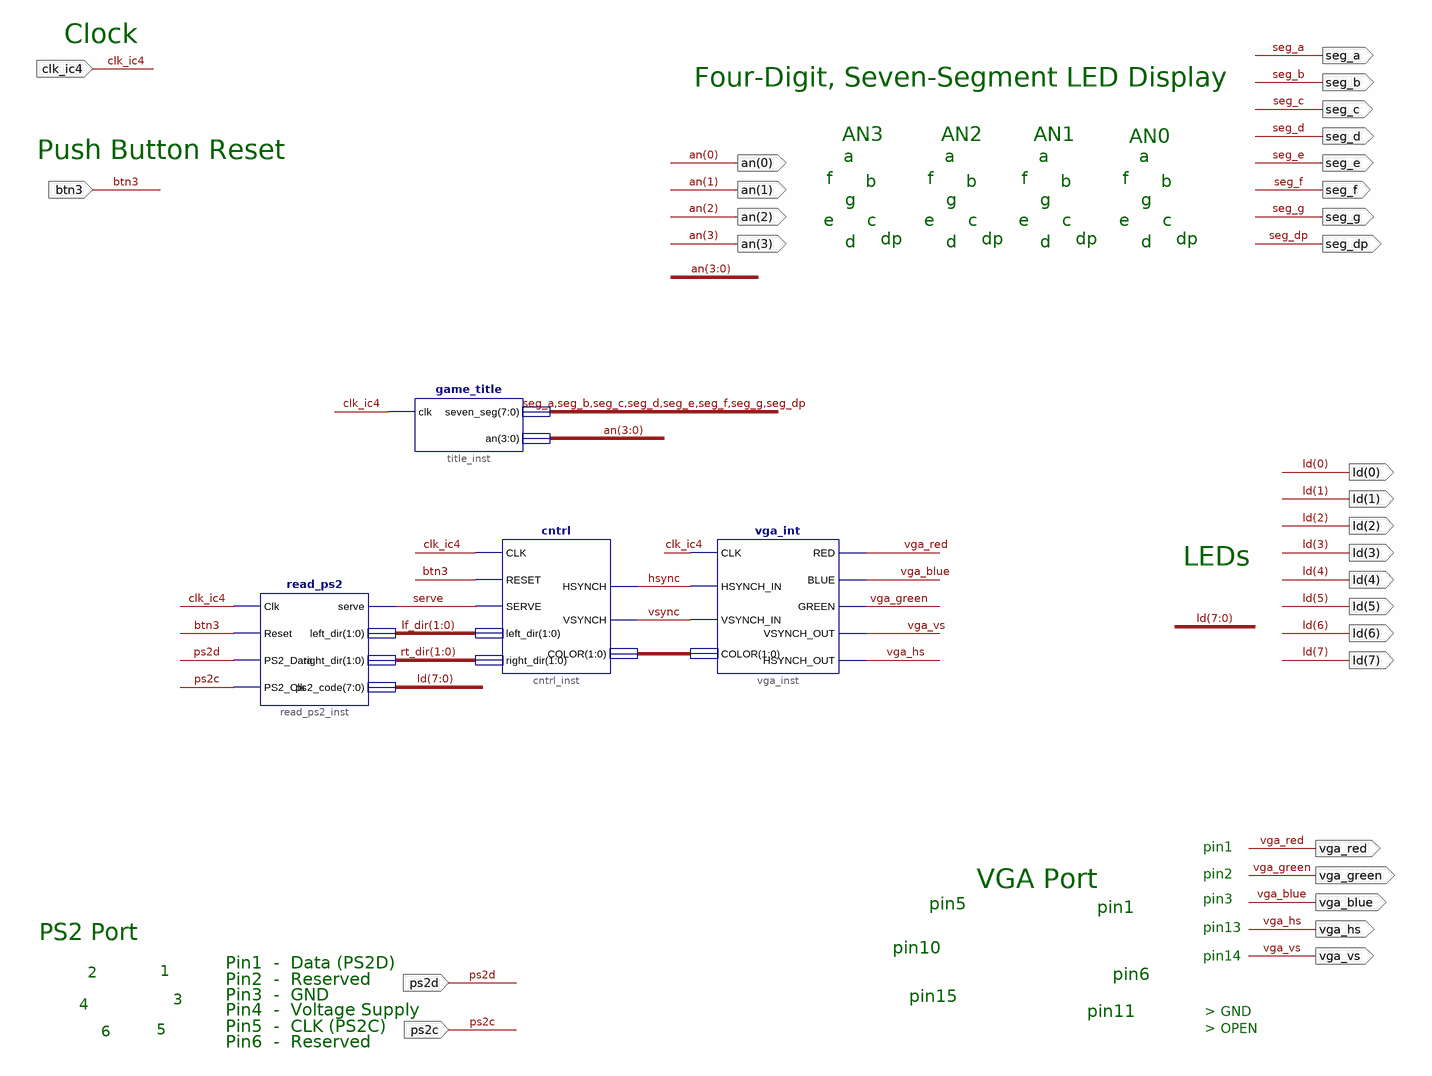
[diagram p0: schematic sheet 1]
// Xilinx ISE schematic pong_top.sch (spartan3e) as structural Verilog: 4 symbols, 29 ports
module pong_top (
  input  ps2c,
  input  clk_ic4,
  input  ps2d,
  input  btn3,
  output seg_a,
  output seg_b,
  output seg_c,
  output seg_d,
  output seg_e,
  output seg_f,
  output seg_g,
  output seg_dp,
  output [3:0] an,
  output vga_red,
  output vga_green,
  output vga_blue,
  output vga_hs,
  output vga_vs,
  output [7:0] ld
);

  wire hsync, serve, vsync;
  wire [1:0] lf_dir, rt_dir, XLXN_31;

  read_ps2 read_ps2_inst (
    .Clk(clk_ic4), .PS2_Clk(ps2c), .PS2_Data(ps2d), .Reset(btn3), .left_dir(lf_dir), .right_dir(rt_dir),
    .serve(serve), .ps2_code(ld));
  cntrl cntrl_inst (
    .CLK(clk_ic4), .RESET(btn3), .SERVE(serve), .HSYNCH(hsync), .VSYNCH(vsync), .COLOR(XLXN_31),
    .left_dir(lf_dir), .right_dir(rt_dir));
  vga_int vga_inst (
    .CLK(clk_ic4), .COLOR(XLXN_31), .RED(vga_red), .BLUE(vga_blue), .GREEN(vga_green), .VSYNCH_OUT(vga_vs),
    .HSYNCH_OUT(vga_hs), .HSYNCH_IN(hsync), .VSYNCH_IN(vsync));
  game_title title_inst (.clk(clk_ic4), .seven_seg({seg_a, seg_b, seg_c, seg_d, seg_e, seg_f, seg_g, seg_dp}), .an(an));

  // Notes on the sheet:
  //   Clock
  //   Four-Digit, Seven-Segment LED Display
  //   AN3
  //   AN2
  //   AN1
  //   AN0
  //   Push Button Reset
  //   a
  //   a
  //   a
  //   a
  //   f
  //   f
  //   f
  //   f
  //   b
  //   b
  //   b
  //   b
  //   g
  //   g
  //   g
  //   g
  //   e
  //   c
  //   e
  //   c
  //   e
  //   c
  //   e
  //   c
  //   dp
  //   dp
  //   dp
  //   dp
  //   d
  //   d
  //   d
  //   d
  //   LEDs
  //   pin1
  //   pin2
  //   VGA Port
  //   pin3
  //   pin5
  //   pin1
  //   pin13
  //   PS2 Port
  //   pin10
  //   pin14
  //   Pin1  -  Data (PS2D)
  //   1
  //   2
  //   pin6
  //   Pin2  -  Reserved
  //   Pin3  -  GND
  //   pin15
  //   3
  //   4
  //   Pin4  -  Voltage Supply
  //   pin11
  //   > GND
  //   Pin5  -  CLK (PS2C)
  //   > OPEN
  //   5
  //   6
  //   Pin6  -  Reserved
  //   LOC on signal seg_a = l18
  //   LOC on signal seg_b = f18
  //   LOC on signal seg_c = d17
  //   LOC on signal seg_d = d16
  //   LOC on signal seg_e = g14
  //   LOC on signal seg_f = j17
  //   LOC on signal seg_g = h14
  //   LOC on signal seg_dp = c17
  //   LOC on signal an(0) = f17
  //   LOC on signal an(1) = h17
  //   LOC on signal an(2) = c18
  //   LOC on signal an(3) = f15
  //   LOC on signal vga_red = r9
  //   LOC on signal vga_green = n8
  //   LOC on signal vga_blue = u5
  //   LOC on signal vga_hs = t4
  //   LOC on signal vga_vs = u3
  //   LOC on signal ps2c = r12
  //   LOC on signal clk_ic4 = b8
  //   LOC on signal ps2d = p11
  //   LOC on signal btn3 = b18
  //   LOC on signal ld(0) = j14
  //   LOC on signal ld(1) = j15
  //   LOC on signal ld(2) = k15
  //   LOC on signal ld(4) = e17
  //   LOC on signal ld(5) = p15
  //   LOC on signal ld(6) = f4
  //   LOC on signal ld(7) = r4
  //   LOC on signal ld(3) = k14
endmodule
